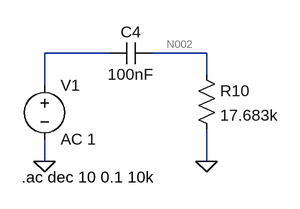
[diagram p0: schematic Experiment_1_b_B.asc]
Experiment_1_b_B.asc, the LTspice schematic file:
Version 4
SHEET 1 880 680
WIRE 176 64 80 64
WIRE 320 64 240 64
WIRE 320 96 320 64
WIRE 80 112 80 64
WIRE 80 224 80 192
WIRE 320 224 320 176
FLAG 80 224 0
FLAG 320 224 0
SYMBOL res 304 80 R0
SYMATTR InstName R10
SYMATTR Value 17.683k
SYMBOL voltage 80 96 R0
SYMATTR InstName V1
SYMATTR Value AC 1
SYMBOL cap 240 48 R90
WINDOW 0 0 32 VBottom 2
WINDOW 3 32 32 VTop 2
SYMATTR InstName C4
SYMATTR Value 100nF
TEXT 46 248 Left 2 !.ac dec 10 0.1 10k

The netlist it stands for:
* Experiment_1_b_B.asc
R10 N002 0 17.683k
V1 N001 0 AC 1
C4 N002 N001 100nF
.ac dec 10 0.1 10k
.backanno
.end

* Results of the author's LTspice run, read from the files saved beside the schematic
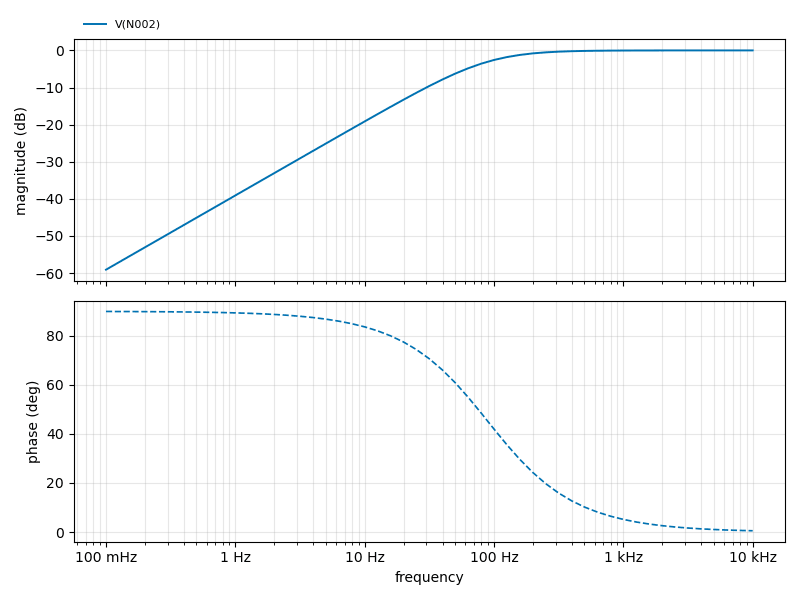
[diagram p1: AC Analysis of Experiment_1_b_B.asc, plotted from the saved traces]
* AC Analysis, 1 run:
*   V(N002): -59.09 dB at 100 mHz, -0.00 dB at 10 kHz, peak -0.00 dB at 10 kHz, 3 dB below the peak at 90.58 Hz